# Altium schematic sheet 3.3V POWER.SchDoc: 3.3V Power
size B; CheckedBy: Lance Bantoto; Engineer: Cindy Li; Organization: Altium Limited; Address1: L3, 12a Rodborough Rd; Address2: Frenchs Forest; Address3: NSW; Address4: Australia 2086; DocumentNumber: 4; Revision: 1; SheetNumber: 4; SheetTotal: 26
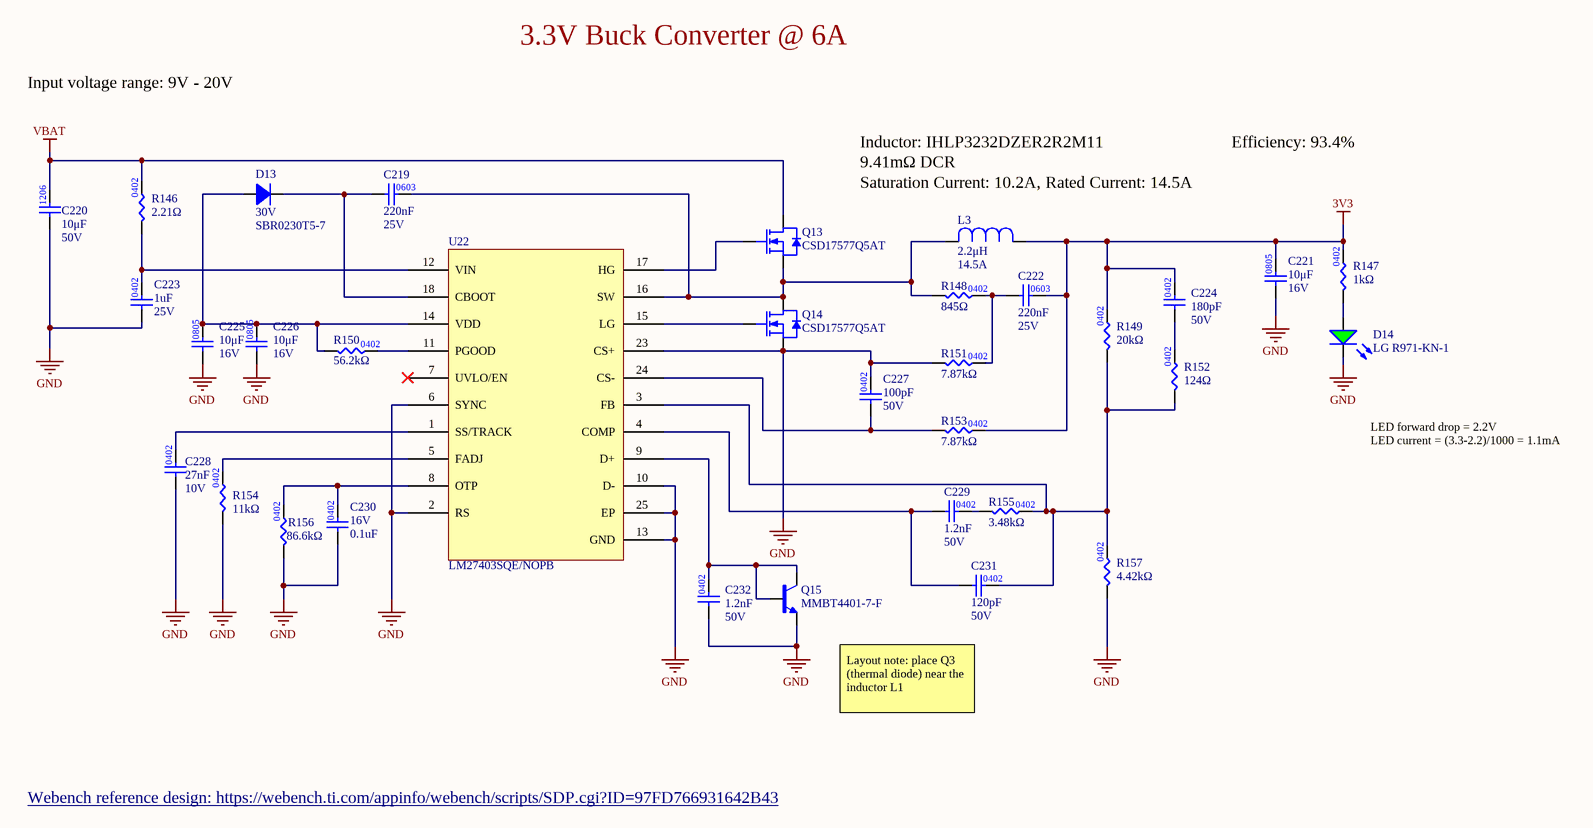
[diagram p0: 3.3V POWER.SchDoc]

## Parts
C219  Capacitance: 220nF  Rated DC Voltage (URdc): 25V  [CAP0402]  (hidden comment: CAP_0.22uF_25V_X5R_0402)
C220  value 10μF  Voltage Rating: 50V  [CAP1210]  (hidden comment: CAP_10uF_50V_1210)
C221  value 10μF  Voltage Rating: 16V  [CAP2012]  (hidden comment: CAP_10uF_16V_0805)
C222  Capacitance: 220nF  Rated DC Voltage (URdc): 25V  [CAP0402]  (hidden comment: CAP_0.22uF_25V_X5R_0402)
C223  Capacitance: 1uF  Voltage: 25V  [CAP0402]  (hidden comment: CAP_1uF_25V_0402)
C224  Capacitance: 180pF  Voltage: 50V  [CAP0402]  (hidden comment: CAP_180pF_50V_0402)
C225  value 10μF  Voltage Rating: 16V  [CAP2012]  (hidden comment: CAP_10uF_16V_0805)
C226  value 10μF  Voltage Rating: 16V  [CAP2012]  (hidden comment: CAP_10uF_16V_0805)
C227  Capacitance: 100pF  Voltage: 50V  [CAP0402]  (hidden comment: CAP_100pF_50V_0402)
C228  Capacitance: 27nF  Rated DC Voltage (URdc): 10V  [CAP0402]  (hidden comment: CAP_0.027uF_10V_X7R_0402)
C229  Capacitance: 1.2nF  Rated DC Voltage (URdc): 50V  [CAP0402]  (hidden comment: CAP_1.2nF_50V_X7R_0402)
C230  Rated DC Voltage (URdc): 16V  Capacitance: 0.1uF  [CAP0402]  (hidden comment: CAP_0.1uF_16V_X7R_0402)
C231  Capacitance: 120pF  Voltage: 50V  [CAP0402]  (hidden comment: CAP_120pF_50V_0402)
C232  Capacitance: 1.2nF  Rated DC Voltage (URdc): 50V  [CAP0402]  (hidden comment: CAP_1.2nF_50V_X7R_0402)
D13  value 30V  [SOD523]  (hidden comment: SBR0230T5-7)
D14  Manufacturer Part Number 1: LG R971-KN-1  [LED_0805_GREEN]  (hidden comment: DIO_LED_G)
L3  Current Rating: 14.5A  Inductance: 2.2μH  [IND_VISHAY_IHLP3232DZER2R2M11]  (hidden comment: IND_2.2uH_14.5A)
Q13  Manufacturer Part Number 1: CSD17577Q5AT  [MOSFET_CSD19531Q5A]  (hidden comment: NMOS_30V_60A)
Q14  Manufacturer Part Number 1: CSD17577Q5AT  [MOSFET_CSD19531Q5A]  (hidden comment: NMOS_30V_60A)
Q15  MMBT4401-7-F  [MMBT4401-7-F]
R146  value 2.21Ω  [RES0402]  (hidden comment: RES_2.21Ω_0402_1%)
R147  Resistance: 1kΩ  [RES0402]  (hidden comment: RES_1kΩ_0402)
R148  value 845Ω  [RES0402]  (hidden comment: RES_845Ω_0402_1%)
R149  value 20kΩ  [RES0402]  (hidden comment: RES_20kΩ_0402_1%)
R150  value 56.2kΩ  [RES0402]  (hidden comment: RES_56.2kΩ_0402_1%)
R151  value 7.87kΩ  [RES0402]  (hidden comment: RES_7.87kΩ_0402_1%)
R152  value 124Ω  [RES0402]  (hidden comment: RES_124Ω_0402_1%)
R153  value 7.87kΩ  [RES0402]  (hidden comment: RES_7.87kΩ_0402_1%)
R154  value 11kΩ  [RES0402]  (hidden comment: RES_11kΩ_0402_1%)
R155  value 3.48kΩ  [RES0402]  (hidden comment: RES_3.48kΩ_0402_1%)
R156  value 86.6kΩ  [RES0402]  (hidden comment: RES_86.6kΩ_0402_1%)
R157  value 4.42kΩ  [RES0402]  (hidden comment: RES_4.42kΩ_0402_1%)
U22  LM27403SQE/NOPB  [QFN50P400X400X80-25N]

## Nets
3V3: C221.2 C222.2 C224.2 L3.1 R147.2 R149.2 R153.2
GND: C220.1 C221.1 C223.1 C225.1 C226.1 C227.2 C228.1 C230.1 C232.1 D14.2(K) Q14.1(Source) Q15.2 R151.1 R154.1 R156.1 R157.1 U22.2(RS) U22.6(SYNC) U22.10(D-) U22.13(GND) U22.23(CS+) U22.25(EP)
VBAT: C220.2 Q13.3(Drain) R146.2
NetC219_1: C219.1 D13.1 U22.18(CBOOT)
NetC219_2: C219.2 L3.2 Q13.1(Source) Q14.3(Drain) R148.1 U22.16(SW)
NetC222_1: C222.1 R148.2 R151.2
NetC223_2: C223.2 R146.1 U22.12(VIN)
NetC224_1: C224.1 R152.2
NetC225_2: C225.2 C226.2 D13.2 R150.1 U22.14(VDD)
NetC227_1: C227.1 R153.1 U22.24(CS-)
NetC228_2: C228.2 U22.1(SS/TRACK)
NetC229_1: C229.1 C231.1 U22.4(COMP)
NetC229_2: C229.2 R155.1
NetC230_2: C230.2 R156.2 U22.8(OTP)
NetC231_2: C231.2 R149.1 R152.1 R155.2 R157.2 U22.3(FB)
NetC232_2: C232.2 Q15.1 Q15.3 U22.9(D+)
NetD14_1: D14.1(A) R147.1
NetQ13_2: Q13.2(Gate) U22.17(HG)
NetQ14_2: Q14.2(Gate) U22.15(LG)
NetR150_2: R150.2 U22.11(PGOOD)
NetR154_2: R154.2 U22.5(FADJ)

Not connected (* = marked no-connect by the designer): U22 7(UVLO/EN)*

## Notes on the sheet
- 3.3V Buck Converter @ 6A
- Input voltage range: 9V - 20V
- Inductor: IHLP3232DZER2R2M11
- 9.41mΩ DCR
- Efficiency: 93.4%
- (near L3) Saturation Current: 10.2A, Rated Current: 14.5A
- LED forward drop = 2.2V
  LED current = (3.3-2.2)/1000 = 1.1mA
- Layout note: place Q3 (thermal diode) near the inductor L1
- Webench reference design: https://webench.ti.com/appinfo/webench/scripts/SDP.cgi?ID=97FD766931642B43 <https://webench.ti.com/appinfo/webench/scripts/SDP.cgi?ID=97FD766931642B43>
- Title:
- Project:
- Date:
- Rev:
- Reviewer:
- Engineer:
- Sheet:
- of
- (in symbol CAP_0.22uF_25V_X5R_0402) 0603
- (in symbol CAP_10uF_50V_1210) 1206

## Library data of the parts
C219 C222 = CAP_0.22uF_25V_X5R_0402: 0.22 µF ±10% 25V Ceramic Capacitor X5R 0402 (1005 Metric); Manufacturer: Yageo; Manufacturer Part Number: CC0402KRX5R8BB224; Multilayer: Yes; Negative Tolerance: 5; Positive Tolerance: 5%; Supplier 1: Digi-Key; Supplier Part Number 1: 311-3341-1-ND; RoHS: Yes; Category: Ceramic Capacitors; Pricing 1: 1=0.10000, 10=0.04000, 50=0.02200, 100=0.01800, 500=0.01288, 1000=0.01012, 2500=0.00920, 5000=0.00846 (USD); Mount: Surface Mount; Number of Pins: 2; Dielectric Material: Ceramic; Package Shape: Rectangular; Min Operating Temperature: -55°C; Max Operating Temperature: 125°C; JESD-609 Code: e3; Capacitor Type: Ceramic; Package Style: SMTMeter; Temperature Characteristics Code: X5R; Termination: Wraparound; Length: 1mm; Width: 0.5mm; Height: 0.5mm; REACH SVHC: Yes; RoHS Compliant: Yes; Size Code: 0402
C220 = CAP_10uF_50V_1210: CAP CER 10UF 50V X7R 1210; Manufacturer 1: Murata Electronics; Manufacturer Part Number 1: GRM32ER71H106MA12L; Dielectric: X7R; Supplier 1: Digi-Key; Supplier Part Number 1: 490-12775-1-ND
C221 C225 C226 = CAP_10uF_16V_0805: CAP CER 10UF 16V X5R 0805; Manufacturer 1: Yageo; Manufacturer Part Number 1: CC0805KKX5R7BB106; Package/Footprint: 0805; Dielectric: X5R; Supplier 1: Digi-Key; Supplier Part Number 1: 311-1865-1-ND; Mounting Type: SMD
C223 = CAP_1uF_25V_0402: ±10% 25V Ceramic Capacitor X5R 0402 (1005 Metric); Manufacturer 1: TDK Corporation; Manufacturer Part Number 1: C1005X5R1E105K050BE; Supplier 1: Digi-Key; Supplier Part Number 1: 445-175215-1-ND; Package: 0402
C224 = CAP_180pF_50V_0402: 180 pF ±10% 50V Ceramic Capacitor X7R 0402 (1005 Metric); Manufacturer 1: AVX Corporation; Manufacturer Part Number 1: 04025C181KAT2A; Supplier 1: Digi-Key; Supplier Part Number 1: 478-1092-1-ND; Package: 0402
C227 = CAP_100pF_50V_0402: 100 pF ±10% 50V Ceramic Capacitor X7R 0402 (1005 Metric); Manufacturer 1: AVX Corporation; Manufacturer Part Number 1: 04025C101KAT2A; Supplier 1: Digi-Key; Supplier Part Number 1: 478-1089-1-ND; Package: 0402
C228 = CAP_0.027uF_10V_X7R_0402: 0.027 µF ±10% 10V Ceramic Capacitor X7R 0402 (1005 Metric); Manufacturer: Yageo; Manufacturer Part Number: CC0402KRX7R6BB273; Multilayer: Yes; Supplier 1: Digi-Key; Supplier Part Number 1: 311-3794-1-ND; RoHS: Yes; Category: Ceramic Capacitors; Pricing 1: 1=0.10000, 10=0.04000, 50=0.02200, 100=0.01800, 500=0.01288, 1000=0.01012, 2500=0.00920, 5000=0.00846 (USD); Mount: Surface Mount; Number of Pins: 2; Dielectric Material: Ceramic; Package Shape: Rectangular; Min Operating Temperature: -55°C; Max Operating Temperature: 125°C; JESD-609 Code: e3; Capacitor Type: Ceramic; Negative Tolerance: 10%; Package Style: SMTMeter; Positive Tolerance: 10%; Temperature Characteristics Code: X7R; Termination: Wraparound; Length: 1mm; Width: 0.5mm; Height: 0.5mm; REACH SVHC: Yes; RoHS Compliant: Yes; Size Code: 0402
C229 C232 = CAP_1.2nF_50V_X7R_0402: 1200 pF ±5% 50V Ceramic Capacitor X7R 0402 (1005 Metric); Manufacturer: Yageo; Manufacturer Part Number: CC0402JRX7R9BB122; Multilayer: Yes; Negative Tolerance: 5; Supplier 1: Digi-Key; Supplier Part Number 1: 311-3762-1-ND; RoHS: Yes; Category: Ceramic Capacitors; Pricing 1: 1=0.10000, 10=0.04000, 50=0.02200, 100=0.01800, 500=0.01288, 1000=0.01012, 2500=0.00920, 5000=0.00846 (USD); Mount: Surface Mount; Number of Pins: 2; Dielectric Material: Ceramic; Package Shape: Rectangular; Min Operating Temperature: -55°C; Max Operating Temperature: 125°C; JESD-609 Code: e3; Capacitor Type: Ceramic; Package Style: SMTMeter; Positive Tolerance: 5%; Temperature Characteristics Code: X7R; Termination: Wraparound; Length: 1mm; Width: 0.5mm; Height: 0.5mm; REACH SVHC: Yes; RoHS Compliant: Yes; Size Code: 0402
C230 = CAP_0.1uF_16V_X7R_0402: Ceramic Capacitor, Ceramic; Manufacturer: Taiyo Yuden; Manufacturer Part Number: LMK212AC6106MD-T; Multilayer: Yes; Negative Tolerance: 10%; Temperature Characteristics Code: X7R; Supplier 1: Digi-Key; Supplier Part Number 1: 587-6337-1-ND; RoHS: Yes; Stock 1: 703; Pricing 1: 1=0.29000, 10=0.20100, 50=0.12060, 100=0.10180, 500=0.06966, 1000=0.06163 (USD); ComponentLink1URL: https://datasheet.ciiva.com:443/pdfs/VipMasterIC/IC/TAIY/TAIY-S-A0009099504/TAIY-S-A0009099407-1.pdf?src-supplier=IHS+Markit; ComponentLink1Description: https://datasheet.ciiva.com:443/pdfs/VipMasterIC/IC/TAIY/TAIY-S-A0009099504/TAIY-S-A0009099407-1.pdf?src-supplier=IHS+Markit; ComponentLink2URL: https://ds.yuden.co.jp/TYCOMPAS/ut/detail?pn=LMK212AC6106MD-T &amp;u=M&src-supplier=Digi-Key; ComponentLink2Description: https://ds.yuden.co.jp/TYCOMPAS/ut/detail?pn=LMK212AC6106MD-T &amp;u=M&src-supplier=Digi-Key; Supplier 2: Digi-Key; Supplier Part Number 2: 1292-1630-1-ND; Category: Ceramic Capacitors; Stock 2: 20327886; Pricing 2: 1=0.10000, 10=0.02800, 50=0.01500, 100=0.01220, 500=0.00876, 1000=0.00688, 2500=0.00625, 5000=0.00575 (USD); Mount: Surface Mount; Number of Pins: 2; Dielectric Material: Ceramic; Package Shape: Rectangular; Terminal Finish: Nickel; Min Operating Temperature: -55°C; Max Operating Temperature: 125°C; JESD-609 Code: e3; Capacitor Type: Ceramic; Package Style: SMTMeter; Packaging: Tape and Reel; Positive Tolerance: 10%; Termination: Wraparound; Length: 1mm; Width: 0.5mm; Height: 0.5mm; REACH SVHC: Yes; RoHS Compliant: Yes; ComponentLink3URL: https://datasheet.ciiva.com:443/pdfs/VipMasterIC/IC/WATC/WATC-S-A0009550342/WATC-S-A0009550342-1.pdf?src-supplier=IHS+Markit; ComponentLink3Description: https://datasheet.ciiva.com:443/pdfs/VipMasterIC/IC/WATC/WATC-S-A0009550342/WATC-S-A0009550342-1.pdf?src-supplier=IHS+Markit; ComponentLink4URL: http://www.farnell.com/datasheets/2340522.pdf?src-supplier=Farnell; ComponentLink4Description: http://www.farnell.com/datasheets/2340522.pdf?src-supplier=Farnell; ComponentLink5URL: http://components.arrow.com/part/dataview/0323_00654690?src-supplier=Arrow+Europe; ComponentLink5Description: http://components.arrow.com/part/dataview/0323_00654690?src-supplier=Arrow+Europe; ComponentLink6URL: https://www.verical.com/server-webapp/html/getDatasheet?partID=415228&src-supplier=Verical; ComponentLink6Description: https://www.verical.com/server-webapp/html/getDatasheet?partID=415228&src-supplier=Verical; ComponentLink7URL: http://www.passivecomponent.com/indexsea/0402B104K160CT-IN.pdf?src-supplier=Digi-Key; ComponentLink7Description: http://www.passivecomponent.com/indexsea/0402B104K160CT-IN.pdf?src-supplier=Digi-Key; ComponentLink8URL: http://www.passivecomponent.com/wp-content/uploads/2018/10/MLCC.pdf?src-supplier=Digi-Key; ComponentLink8Description: http://www.passivecomponent.com/wp-content/uploads/2018/10/MLCC.pdf?src-supplier=Digi-Key; ComponentLink9URL: http://www.farnell.com/datasheets/2340522.pdf?src-supplier=Element14; ComponentLink9Description: http://www.farnell.com/datasheets/2340522.pdf?src-supplier=Element14; ComponentLink10URL: http://www.farnell.com/datasheets/2340522.pdf?src-supplier=Newark; ComponentLink10Description: http://www.farnell.com/datasheets/2340522.pdf?src-supplier=Newark; Size Code: 0402; Supplier 3: Digi-Key; Supplier Part Number 3: 445-173645-1-ND; Stock 3: 3627; Pricing 3: 1=0.20000, 10=0.14200, 50=0.08080, 100=0.06700, 500=0.04696, 1000=0.03888, 2500=0.03619, 5000=0.03311 (USD); ComponentLink11URL: https://datasheet.ciiva.com:443/pdfs/VipMasterIC/IC/TDKC/TDKC-S-A0007785269/TDKC-S-A0007785269-1.pdf?src-supplier=IHS+Markit; ComponentLink11Description: https://datasheet.ciiva.com:443/pdfs/VipMasterIC/IC/TDKC/TDKC-S-A0007785269/TDKC-S-A0007785269-1.pdf?src-supplier=IHS+Markit; ComponentLink12URL: https://product.tdk.com/info/en/catalog/spec/mlccspec_commercial_soft_en.pdf?src-supplier=Digi-Key; ComponentLink12Description: https://product.tdk.com/info/en/catalog/spec/mlccspec_commercial_soft_en.pdf?src-supplier=Digi-Key
C231 = CAP_120pF_50V_0402: 120 pF ±10% 50V Ceramic Capacitor X7R 0402 (1005 Metric); Manufacturer 1: AVX Corporation; Manufacturer Part Number 1: 04025C121KAT2A; Supplier 1: Digi-Key; Supplier Part Number 1: 478-1090-1-ND; Package: 0402
D13 = DIO_30V_200mA: Diode Super Barrier 30 V 200mA Surface Mount SOD-523; Manufacturer 1: Diodes Incorporated; Supplier 1: Digi-Key; Supplier Part Number 1: SBR0230T5-7TR-ND; Manufacturer Part Number 1: SBR0230T5-7
D14 = DIO_LED_G: LED GREEN DIFFUSED 0805 SMD; Manufacturer 1: OSRAM; Forward Voltage Drop: 2.2V; Package/Footprint: 0805; Supplier Part Number 1: 475-1410-1-ND; Supplier 1: Digi-Key; Mounting Type: SMD
L3 = IND_2.2uH_14.5A: FIXED IND 2.2UH 14.5A 9.41 MOHM; Manufacturer 1: Vishay Dale; Manufacturer Part Number 1: IHLP3232DZER2R2M11; Inductance Tolerance: 20%; Saturation Current: 10.2A; Test Frequency: 100kHz; DC Resistance (DCR): 9.41mOhm; Mounting Type: SMD; Supplier 1: Digi-Key; Supplier Part Number 1: 541-1350-1-ND
Q13 Q14 = NMOS_30V_60A: MOSFET N-CH 30V 60A 8VSON; Manufacturer 1: Texas Instruments; Package/Footprint: 8-PowerTDFN; Vgs (Max): ±20V; Supplier 1: Digi-Key; Supplier Part Number 1: 296-38337-1-ND; Mounting Type: SMD; Verified: No; Id: 60A; Vdss: 30V
Q15 = MMBT4401-7-F: Bipolar (BJT) Transistor NPN 40 V 600 mA 250MHz 310 mW Surface Mount SOT-23-3; Manufacturer 1: Diodes Incorporated; Current - Collector Cutoff (Max): 100nA; Vce Saturation (Max) @ Ib, Ic: 750mV @ 50mA, 500mA; Current - Collector (Ic) (Max): 600mA; Manufacturer Part Number 1: MMBT4401-7-F; Supplier 1: Digi-Key; Supplier Part Number 1: MMBT4401-FDICT-ND; Frequency - Transition: 250MHz
R146 = RES_2.21Ω_0402_1%: RES 2.21 OHM 1% 1/16W 0402; Manufacturer Part Number 1: RMCF0402FT2R21; Manufacturer 1: Yageo; Power: 0.063W, 1/16W; Package/Footprint: 0402; Supplier 1: Digi-Key; Supplier Part Number 1: RMCF0402FT2R21CT-ND; Mounting Type: SMD; Tolerance: 1%
R147 = RES_1kΩ_0402: Fixed Resistor, Metal Glaze/thick Film, 0.063W, 1000ohm, 50V, 1% +/-Tol, 100ppm/Cel, Surface Mount, 0402; Manufacturer: Stackpole Electronics; Manufacturer Part Number: RMCF0402FT1K00; Rated Power Dissipation (P): 63mW; Rated Temperature: 70°C; Temperature Coefficient: 100ppm/°C; Package Height: 0.3mm; Package Length: 1mm; Package Width: 0.5mm; Reference Standard: AEC-Q200; Supplier 1: Digi-Key; Supplier Part Number 1: RMCF0402FT1K00CT-ND; RoHS: Yes; Category: Chip SMD Resistors; Stock 1: 277; Pricing 1: 1=0.10000, 10=0.01500, 100=0.00610, 1000=0.00274, 2500=0.00238, 5000=0.00197 (USD); Mount: Surface Mount; Number of Pins: 2; Package Shape: Rectangular; Terminal Finish: Nickel; Min Operating Temperature: -55°C; Max Operating Temperature: 155°C; Tolerance: 1%; JESD-609 Code: e3; Resistor Type: FIXED RESISTOR; Construction: Rectangular; Package Style: SMTMeter; Packaging: Tape and Reel; Technology: METAL GLAZE/THICK FILM; Termination: Wraparound; Working Voltage: 50V; REACH SVHC: Yes; RoHS Compliant: Yes; ComponentLink1URL: https://datasheet.ciiva.com:443/pdfs/VipMasterIC/IC/SEIE/SEIE-S-A0009541969/SEIE-S-A0009541969-1.pdf?src-supplier=IHS+Markit; ComponentLink1Description: https://datasheet.ciiva.com:443/pdfs/VipMasterIC/IC/SEIE/SEIE-S-A0009541969/SEIE-S-A0009541969-1.pdf?src-supplier=IHS+Markit; ComponentLink2URL: https://datasheet.ciiva.com/15193/getdatasheetpartid-365385-15193418.pdf?src-supplier=Verical; ComponentLink2Description: https://datasheet.ciiva.com/15193/getdatasheetpartid-365385-15193418.pdf?src-supplier=Verical; ComponentLink3URL: https://datasheet.ciiva.com/24336/sei-rmcp-24336266.pdf?src-supplier=Onlinecomponents.com; ComponentLink3Description: https://datasheet.ciiva.com/24336/sei-rmcp-24336266.pdf?src-supplier=Onlinecomponents.com; Size Code: 0402
R148 = RES_845Ω_0402_1%: RES SMD 845 OHM 1% 1/16W 0402; Manufacturer Part Number 1: CRCW0402845RFKED; Manufacturer 1: Vishay Dale; Power: 0.063W, 1/16W; Package/Footprint: 0402; Supplier 1: Digi-Key; Supplier Part Number 1: 541-845LCT-ND; Mounting Type: SMD; Tolerance: 1%
R149 = RES_20kΩ_0402_1%: RES SMD 20K OHM 1% 1/16W 0402; Manufacturer Part Number 1: RC0402FR-0720KL; Manufacturer 1: Yageo; Power: 0.063W, 1/16W; Package/Footprint: 0402; Supplier 1: Digi-Key; Supplier Part Number 1: 311-20.0KLRCT-ND; Mounting Type: SMD; Tolerance: 1%
R150 = RES_56.2kΩ_0402_1%: RES SMD 56.2K OHM 1% 1/16W 0402; Manufacturer Part Number 1: RC0402FR-0756K2L; Manufacturer 1: Yageo; Power: 0.063W, 1/16W; Package/Footprint: 0402; Supplier 1: Digi-Key; Supplier Part Number 1: YAG3187CT-ND; Mounting Type: SMD; Tolerance: 1%
R151 R153 = RES_7.87kΩ_0402_1%: RES 7.87K OHM 1% 1/16W 0402; Manufacturer Part Number 1: RMCF0402FT7K87; Manufacturer 1: Vishay Dale; Power: 0.063W, 1/16W; Package/Footprint: 0402; Supplier 1: Digi-Key; Supplier Part Number 1: RMCF0402FT7K87CT-ND; Mounting Type: SMD; Tolerance: 1%
R152 = RES_124Ω_0402_1%: RES SMD 124 OHM 1% 1/16W 0402; Manufacturer Part Number 1: RC0402FR-07124RL; Manufacturer 1: Vishay Dale; Power: 0.063W, 1/16W; Package/Footprint: 0402; Supplier 1: Digi-Key; Supplier Part Number 1: 311-124LRCT-ND; Mounting Type: SMD; Tolerance: 1%
R154 = RES_11kΩ_0402_1%: RES 11K OHM 1% 1/16W 0402; Manufacturer Part Number 1: RMCF0402FT11K0; Manufacturer 1: Stackpole Electronics Inc; Power: 0.063W, 1/16W; Package/Footprint: 0402; Supplier 1: Digi-Key; Supplier Part Number 1: RMCF0402FT11K0CT-ND; Mounting Type: SMD; Tolerance: 1%
R155 = RES_3.48kΩ_0402_1%: RES SMD 3.48K OHM 1% 1/16W 0402; Manufacturer Part Number 1: RC0402FR-073K48L; Manufacturer 1: Vishay Dale; Power: 0.063W, 1/16W; Package/Footprint: 0402; Supplier 1: Digi-Key; Supplier Part Number 1: YAG3148CT-ND; Mounting Type: SMD; Tolerance: 1%
R156 = RES_86.6kΩ_0402_1%: RES SMD 86.6K OHM 1% 1/16W 0402; Manufacturer Part Number 1: RC0402FR-0786K6L; Manufacturer 1: Yageo; Power: 0.063W, 1/16W; Package/Footprint: 0402; Supplier 1: Digi-Key; Supplier Part Number 1: YAG3249CT-ND; Mounting Type: SMD; Tolerance: 1%
R157 = RES_4.42kΩ_0402_1%: RES 4.42K OHM 1% 1/16W 0402; Manufacturer Part Number 1: RMCF0402FT4K42; Manufacturer 1: Stackpole Electronics Inc; Power: 0.063W, 1/16W; Package/Footprint: 0402; Supplier 1: Digi-Key; Supplier Part Number 1: RMCF0402FT4K42CT-ND; Mounting Type: SMD; Tolerance: 1%
U22 = LM27403SQE/NOPB: Buck Regulator Positive Output Step-Down - DC-DC Controller IC 24-WQFN (4x4); Manufacturer 1: Texas Instruments; Supply Voltage: 3V - 20V; Switching Frequency: 200kHz - 1.2MHz; Max Duty Cycle: 93%; Manufacturer Part Number 1: LM27403SQE/NOPB; Supplier Part Number 1: 296-37066-1-ND; Supplier 1: Digi-Key; Package: 24-WQFN Exposed Pad